# EAGLE design squematic (EAGLE 7.6.0)
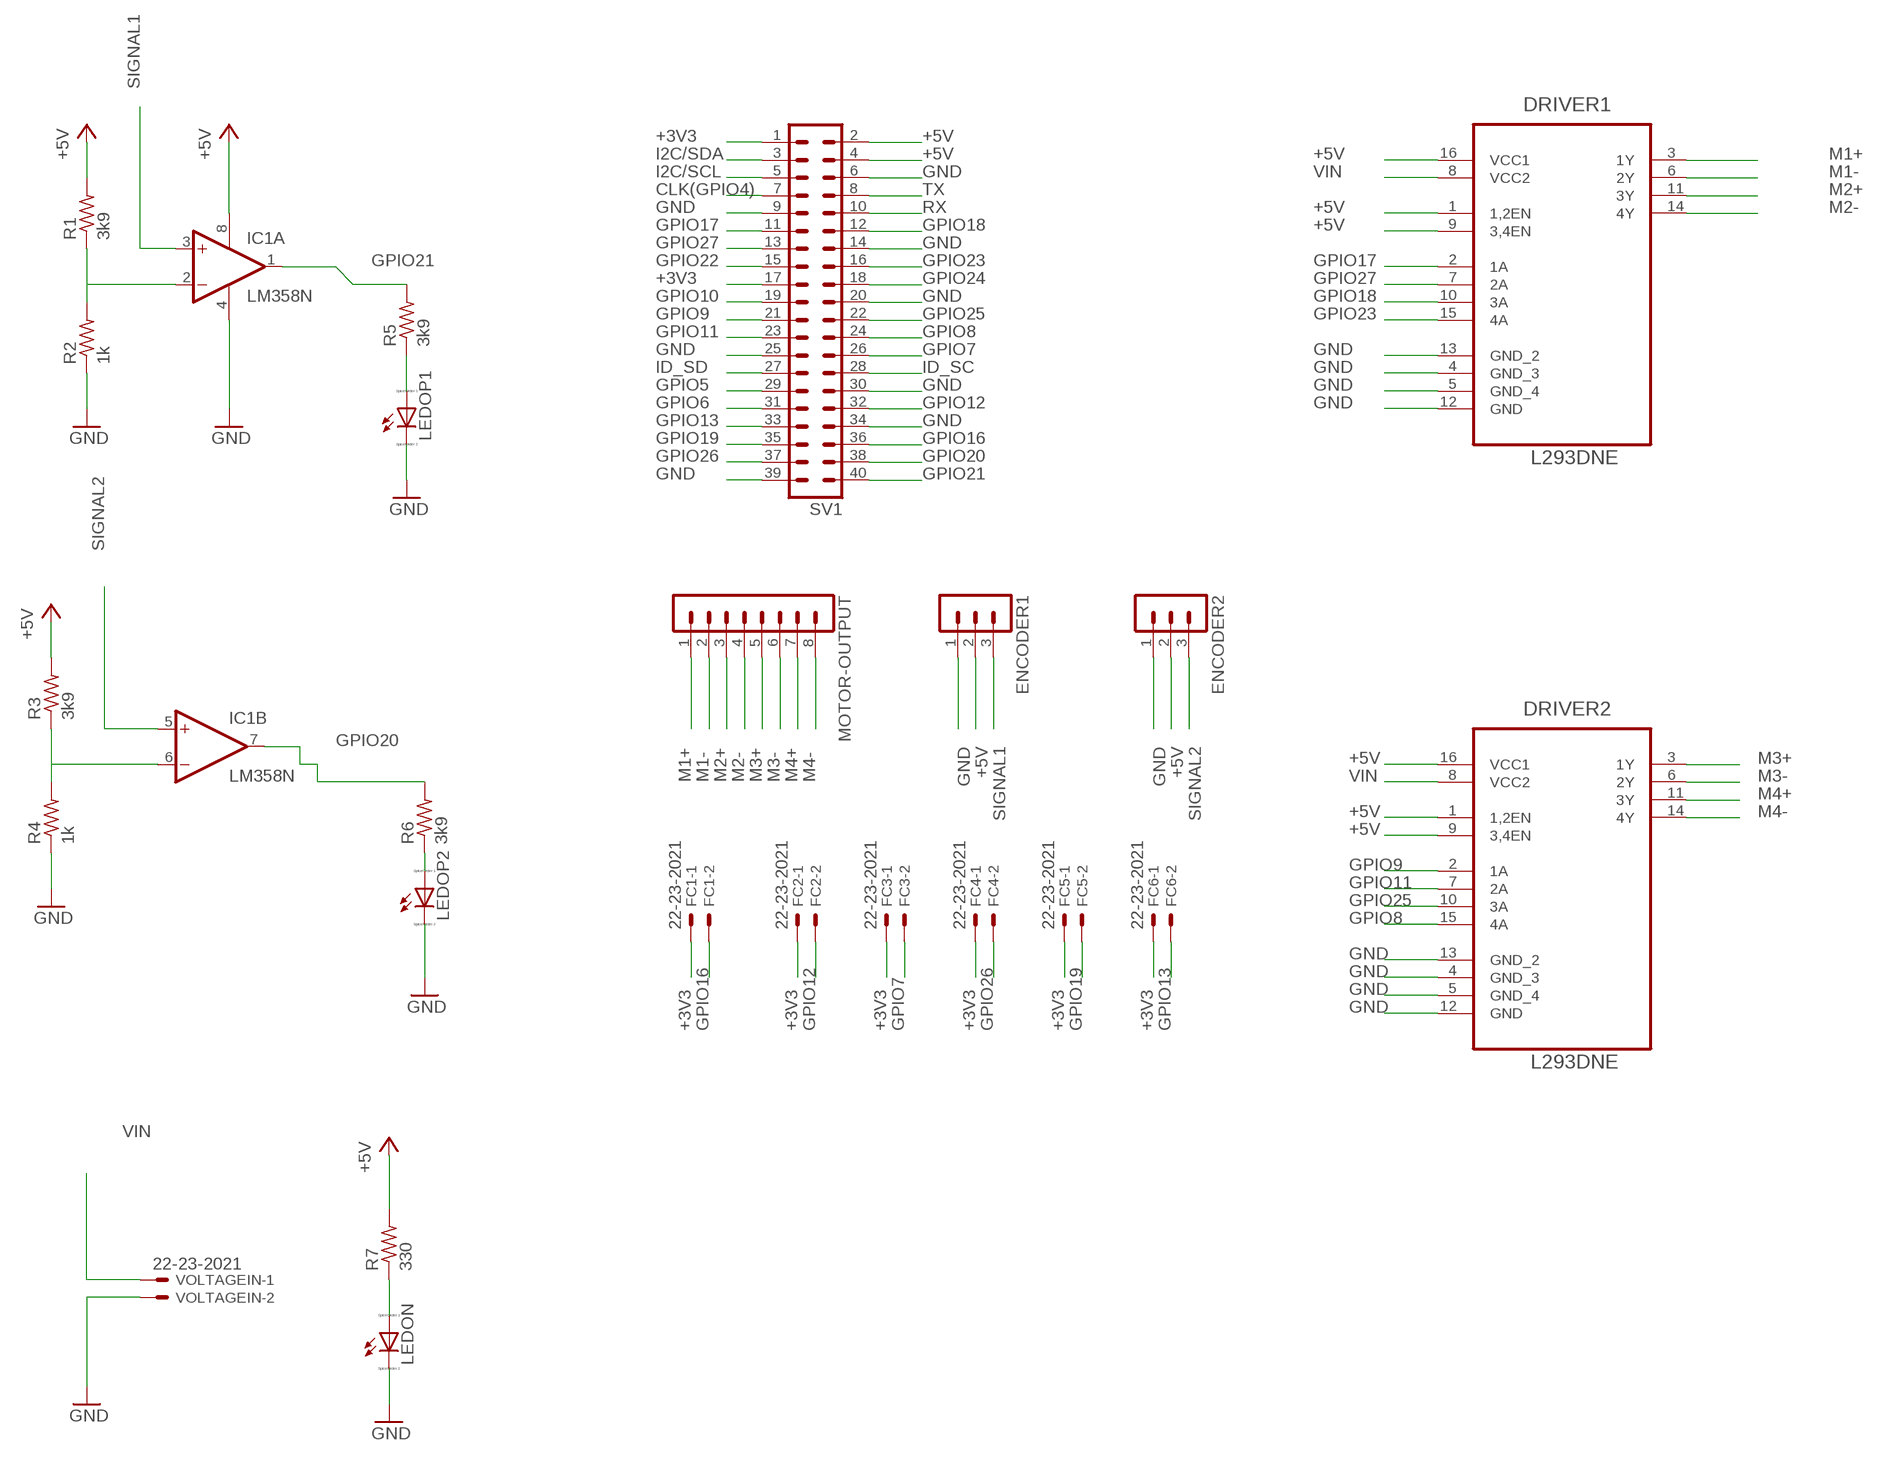
[diagram p0: schematic, sheet 1]

## Parts
DRIVER1  L293DNE  [DIP254P762X508-16]
DRIVER2  L293DNE  [DIP254P762X508-16]
ENCODER1  MA03-1  [MA03-1]
ENCODER2  MA03-1  [MA03-1]
FC1  22-23-2021  [22-23-2021]
FC2  22-23-2021  [22-23-2021]
FC3  22-23-2021  [22-23-2021]
FC4  22-23-2021  [22-23-2021]
FC5  22-23-2021  [22-23-2021]
FC6  22-23-2021  [22-23-2021]
IC1  LM358N  [DIL08]
LEDON  LED_ELD260  [LED_LD260]
LEDOP1  LED_ELD260  [LED_LD260]
LEDOP2  LED_ELD260  [LED_LD260]
MOTOR-OUTPUT  MA08-1  [MA08-1]
R1  3k9  R-US_0207/10  [0207/10]
R2  1k  R-US_0207/10  [0207/10]
R3  3k9  R-US_0207/10  [0207/10]
R4  1k  R-US_0207/10  [0207/10]
R5  3k9  R-US_0207/10  [0207/10]
R6  3k9  R-US_0207/10  [0207/10]
R7  330  R-US_0207/10  [0207/10]
SV1  MA20-2  [MA20-2]
VOLTAGEIN  22-23-2021  [22-23-2021]

## Nets
+3V3: FC1.1 FC2.1 FC3.1 FC4.1 FC5.1 FC6.1 SV1.1 SV1.17
+5V: DRIVER1.1(1,2EN) DRIVER1.9(3,4EN) DRIVER1.16(VCC1) DRIVER2.1(1,2EN) DRIVER2.9(3,4EN) DRIVER2.16(VCC1) ENCODER1.2 ENCODER2.2 IC1.8(P:V+) R1.2 R3.2 R7.2 SV1.2 SV1.4
CLK(GPIO4): SV1.7
GND: DRIVER1.4(GND_3) DRIVER1.5(GND_4) DRIVER1.12(GND) DRIVER1.13(GND_2) DRIVER2.4(GND_3) DRIVER2.5(GND_4) DRIVER2.12(GND) DRIVER2.13(GND_2) ENCODER1.1 ENCODER2.1 IC1.4(P:V-) LEDON.K(C) LEDOP1.K(C) LEDOP2.K(C) R2.1 R4.1 SV1.6 SV1.9 SV1.14 SV1.20 SV1.25 SV1.30 SV1.34 SV1.39 VOLTAGEIN.2
GPIO5: SV1.29
GPIO6: SV1.31
GPIO7: FC3.2 SV1.26
GPIO8: DRIVER2.15(4A) SV1.24
GPIO9: DRIVER2.2(1A) SV1.21
GPIO10: SV1.19
GPIO11: DRIVER2.7(2A) SV1.23
GPIO12: FC2.2 SV1.32
GPIO13: FC6.2 SV1.33
GPIO16: FC1.2 SV1.36
GPIO17: DRIVER1.2(1A) SV1.11
GPIO18: DRIVER1.10(3A) SV1.12
GPIO19: FC5.2 SV1.35
GPIO20: IC1.7(B:OUT) R6.2 SV1.38
GPIO21: IC1.1(A:OUT) R5.2 SV1.40
GPIO22: SV1.15
GPIO23: DRIVER1.15(4A) SV1.16
GPIO24: SV1.18
GPIO25: DRIVER2.10(3A) SV1.22
GPIO26: FC4.2 SV1.37
GPIO27: DRIVER1.7(2A) SV1.13
I2C/SCL: SV1.5
I2C/SDA: SV1.3
ID_SC: SV1.28
ID_SD: SV1.27
M1+: DRIVER1.3(1Y) MOTOR-OUTPUT.1
M1-: DRIVER1.6(2Y) MOTOR-OUTPUT.2
M2+: DRIVER1.11(3Y) MOTOR-OUTPUT.3
M2-: DRIVER1.14(4Y) MOTOR-OUTPUT.4
M3+: DRIVER2.3(1Y) MOTOR-OUTPUT.5
M3-: DRIVER2.6(2Y) MOTOR-OUTPUT.6
M4+: DRIVER2.11(3Y) MOTOR-OUTPUT.7
M4-: DRIVER2.14(4Y) MOTOR-OUTPUT.8
N$1: IC1.2(A:-IN) R1.1 R2.2
N$2: IC1.6(B:-IN) R3.1 R4.2
N$3: LEDOP1.A R5.1
N$7: LEDOP2.A R6.1
N$8: LEDON.A R7.1
RX: SV1.10
SIGNAL1: ENCODER1.3 IC1.3(A:+IN)
SIGNAL2: ENCODER2.3 IC1.5(B:+IN)
TX: SV1.8
VIN: DRIVER1.8(VCC2) DRIVER2.8(VCC2) VOLTAGEIN.1

## Library data of the parts
DRIVER1 DRIVER2 = Texas Instruments_By_element14_Batch_1:L293DNE: QUADRUPLE HALF-H DRIVERS; MPN: L293DNE; OC_FARNELL: 1470423; OC_NEWARK: 06F9523; PACKAGE: PDIP-16; SUPPLIER: Texas Instruments
ENCODER1 ENCODER2 = con-lstb:MA03-1: PIN HEADER; OC_FARNELL: unknown; OC_NEWARK: unknown
FC1-FC6 VOLTAGEIN = con-molex:22-23-2021: .100" (2.54mm) Center Header - 2 Pin; MF: MOLEX; MPN: 22-23-2021; OC_FARNELL: 1462926; OC_NEWARK: 25C3832
IC1 = linear:LM358: OP AMP also LM158; LM258; LM2904 Source: http://cache.national.com/ds/LM/LM158.pdf
LEDON LEDOP1 LEDOP2 = eagle-ltspice:LED_E: LED Source: http://www.osram.convergy.de Source: www.luxeon.com Source: www.kingbright.com; SPICEMODEL: NONE; SPICEPREFIX: D; SPICETYPE: diode
MOTOR-OUTPUT = con-lstb:MA08-1: PIN HEADER; OC_FARNELL: unknown; OC_NEWARK: unknown
R1-R7 = rcl:R-US_: RESISTOR, American symbol
SV1 = con-lstb:MA20-2: PIN HEADER; OC_FARNELL: unknown; OC_NEWARK: unknown

## Board
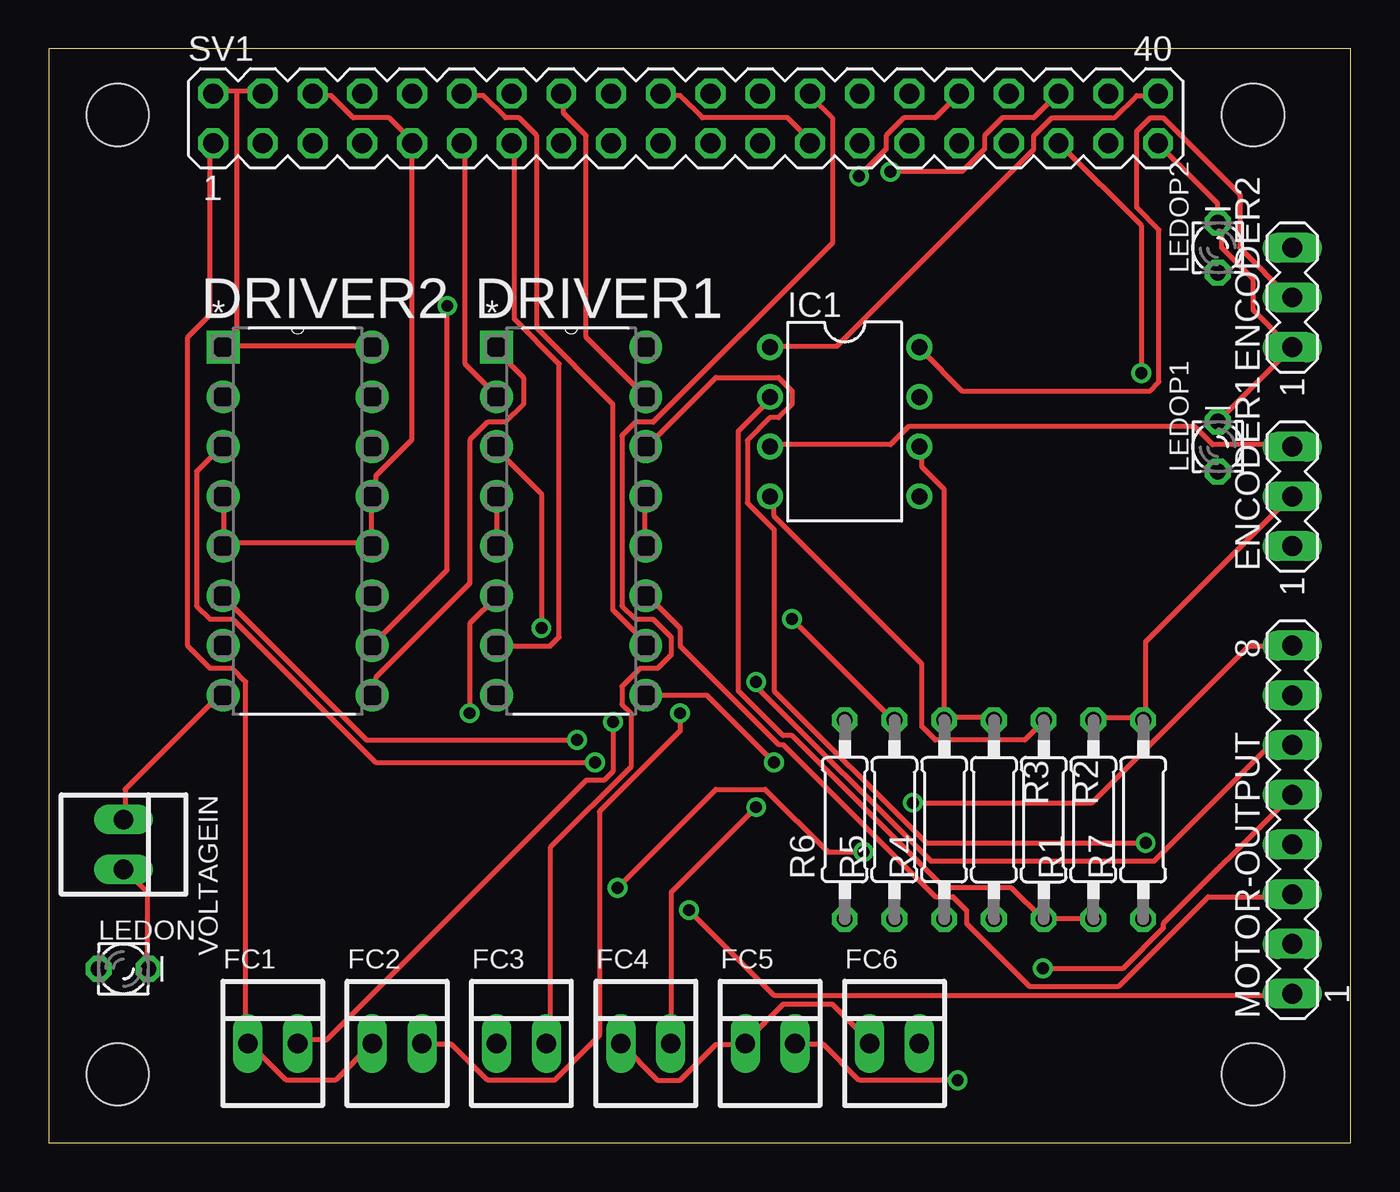
[diagram p1: board, top side]
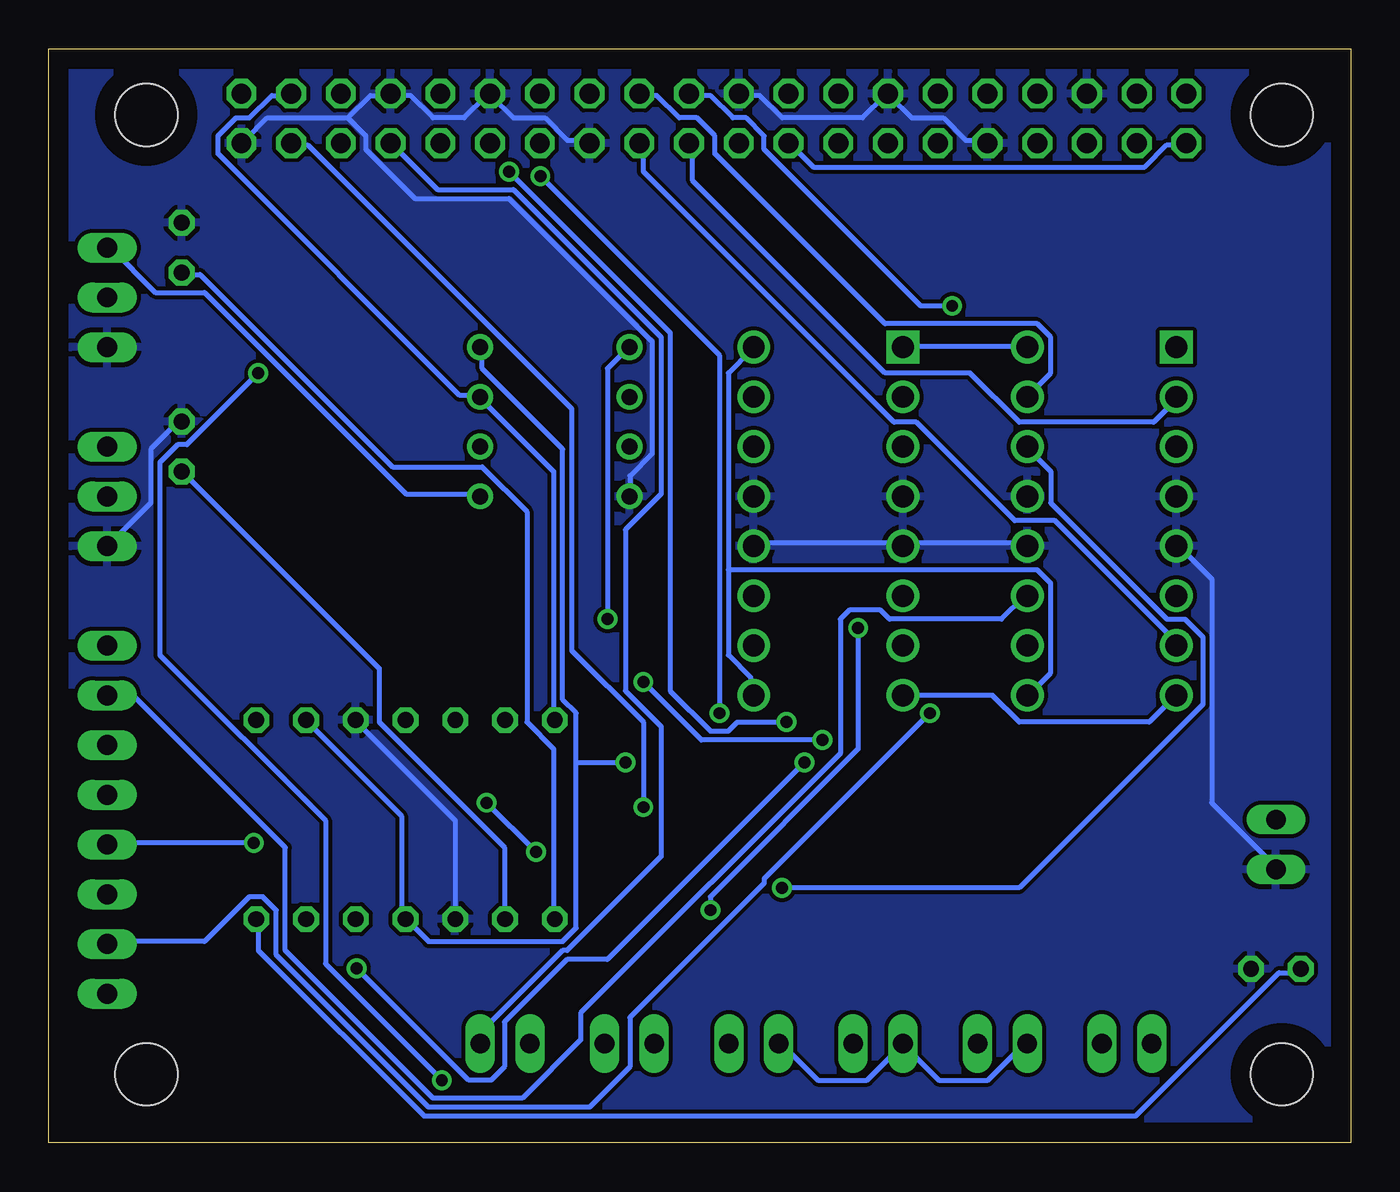
[diagram p2: board, bottom side, seen from below]

Size 66.47 x 55.87 mm. Coordinates in mm from the lower left corner, seen from the top.
Outline: 0,0 66.47,0 66.47,55.87 0,55.87 0,0
Copper layers (1*16): Top 0.035mm / dielectric 1.5mm / Bottom 0.035mm
Design rules "default": minimum track width 10mil, minimum drill 24mil, track to track 8mil, track to pad 8mil, pad to pad 8mil, via to via 8mil, smd to smd 8mil, copper to edge 40mil, drill to drill 8mil, minimum pad ring 10mil, minimum via ring 8mil, stop-mask expansion 4mil, vias tented up to drill 0mil, thermal gap 10mil
Holes 3.17 mm at 3.51,52.5 61.49,52.5 61.49,3.51 3.51,3.51

### Footprints (pad centres in the part's own frame; a part is rotated, then mirrored left to right if it is on the bottom)
DIP254P762X508-16 = drill 1.118 square: 1 -7.62,17.78 | drill 1.118: 2 -7.62,15.24; 3 -7.62,12.7; 4 -7.62,10.16; 5 -7.62,7.62; 6 -7.62,5.08; 7 -7.62,2.54; 8 -7.62,0; 9 0,0; 10 0,2.54; 11 0,5.08; 12 0,7.62; 13 0,10.16; 14 0,12.7; 15 0,15.24; 16 0,17.78
MA03-1 = drill 1.016 long: 1 -2.54,0; 2 0,0; 3 2.54,0
22-23-2021 = drill 1 long: 1 -1.27,0; 2 1.27,0
DIL08 = drill 0.813 pad 1.27: 1 -3.81,-3.81; 2 -1.27,-3.81; 3 1.27,-3.81; 4 3.81,-3.81; 5 3.81,3.81; 6 1.27,3.81; 7 -1.27,3.81; 8 -3.81,3.81
LED_LD260 = drill 0.813 octagon: A -1.27,0; K 1.27,0
MA08-1 = drill 1.016 long: 1 -8.89,0; 2 -6.35,0; 3 -3.81,0; 4 -1.27,0; 5 1.27,0; 6 3.81,0; 7 6.35,0; 8 8.89,0
0207/10 = drill 0.813 octagon: 1 -5.08,0; 2 5.08,0
MA20-2 = drill 1.016 octagon: 1 -24.13,-1.27; 2 -24.13,1.27; 3 -21.59,-1.27; 4 -21.59,1.27; 5 -19.05,-1.27; 6 -19.05,1.27; 7 -16.51,-1.27; 8 -16.51,1.27; 9 -13.97,-1.27; 10 -13.97,1.27; 11 -11.43,-1.27; 12 -11.43,1.27; 13 -8.89,-1.27; 14 -8.89,1.27; 15 -6.35,-1.27; 16 -6.35,1.27; 17 -3.81,-1.27; 18 -3.81,1.27; 19 -1.27,-1.27; 20 -1.27,1.27; 21 1.27,-1.27; 22 1.27,1.27; 23 3.81,-1.27; 24 3.81,1.27; 25 6.35,-1.27; 26 6.35,1.27; 27 8.89,-1.27; 28 8.89,1.27; 29 11.43,-1.27; 30 11.43,1.27; 31 13.97,-1.27; 32 13.97,1.27; 33 16.51,-1.27; 34 16.51,1.27; 35 19.05,-1.27; 36 19.05,1.27; 37 21.59,-1.27; 38 21.59,1.27; 39 24.13,-1.27; 40 24.13,1.27

### Placement (x,y rotation side)
DRIVER1  30.48,22.86 0 top
DRIVER2  16.51,22.86 0 top
ENCODER1  63.5,33.02 90 top
ENCODER2  63.5,43.18 90 top
FC1  11.43,5.08 0 top
FC2  17.78,5.08 0 top
FC3  24.13,5.08 0 top
FC4  30.48,5.08 0 top
FC5  36.83,5.08 0 top
FC6  43.18,5.08 0 top
IC1  40.64,36.83 270 top
LEDON  3.81,8.89 0 top
LEDOP1  59.69,35.56 90 top
LEDOP2  59.69,45.72 90 top
MOTOR-OUTPUT  63.5,16.51 90 top
R1  53.34,16.51 90 top
R2  50.8,16.51 270 top
R3  48.26,16.51 270 top
R4  45.72,16.51 90 top
R5  330  [0207/10]  43.18,16.51 90 top
R6  330  [0207/10]  40.64,16.51 90 top
R7  55.88,16.51 90 top
SV1  32.51,52.32 0 top
VOLTAGEIN  3.81,15.24 270 top

### Tracks (layer width: path | path; a pad name or v marks a point on that pad's centre or on a via)
+3V3
  Top 0.254: FC6.1 41.83,5.26 40.01,7.09 37.49,7.09 35.66,5.26 FC5.1 35.43,5.03 34.06,5.03 32.23,3.2 31.09,3.2 FC4.1 | FC2.1 14.63,3.2 12.12,3.2 10.29,5.03 FC1.1 10.06,5.26 10.06,23.55 9.37,24.23 8.23,24.23 7.09,25.38 7.09,41.15 8.23,42.29 8.23,50.98 SV1.1
  Bottom 0.254: SV1.1 8.46,50.98 9.37,50.98 10.52,49.84 27.43,49.84 28.57,50.98 SV1.17 | 22.86,5.03 24.69,3.2 27.2,3.2 29.03,5.03 FC4.1 | 22.86,5.03 21.03,3.2 18.52,3.2 16.69,5.03 FC2.1 | 22.86,5.03 FC3.1
+5V  (via drill 0.61)
  Top 0.254: 9.6,53.72 10.74,53.72 SV1.4 | 9.6,53.72 8.46,53.72 SV1.2 | 9.6,40.69 16.46,40.69 DRIVER2.16 | 9.6,40.69 8.91,40.69 DRIVER2.1 9.6,40.69 | 9.6,40.69 9.6,53.72 | DRIVER2.9 16.69,22.86 16.69,23.77 21.49,28.57 21.49,35.89 22.4,36.8 23.32,36.8 24.23,37.72 24.23,39.09 22.86,40.46 DRIVER1.1 | R1.2 53.49,21.72 55.78,21.72 R7.2 56.01,21.72 56.01,25.6 63.32,32.92 ENCODER1.2 | ENCODER2.2 63.32,43.2 60.81,45.72 60.81,48.46 56.92,52.35 56.24,52.35 55.55,51.66 55.55,47.78 56.69,46.63 56.69,38.86 56.24,38.41 46.63,38.41 44.58,40.46 IC1.8 | DRIVER1.9 33.6,22.86 v37.03,19.43
  Bottom 0.254: 31.77,29.26 31.77,39.32 30.63,40.46 DRIVER1.16 | 31.77,29.26 31.77,24.92 30.63,23.77 30.63,22.86 DRIVER1.9 | 31.77,29.26 16,29.26 15.32,28.57 15.32,24 16.46,22.86 DRIVER2.9 | DRIVER2.16 16.69,40.69 22.86,40.69 DRIVER1.1 | R1.2 53.26,21.49 48.46,16.69 48.46,11.43 R3.2 48.23,11.43 47.09,10.29 40.23,10.29 39.55,10.97 39.55,19.43 | 39.55,19.43 39.55,21.95 40.23,22.63 40.23,35.43 44.35,39.55 44.35,40.46 IC1.8 | 39.55,19.43 v37.03,19.43
GND
  Top 0.254: LEDON.K 5.03,8.91 5.03,12.8 3.89,13.95 VOLTAGEIN.2 | DRIVER1.12 30.4,30.63 30.4,32.92 DRIVER1.13 | DRIVER1.4 DRIVER1.5 | 8.91,30.63 8.91,32.92 DRIVER2.4 | 16.46,30.63 16.46,32.92 DRIVER2.13 16.69,33.15 16.69,34.06 18.52,35.89 18.52,50.98 SV1.9 18.52,51.21 17.37,52.35 15.54,52.35 14.4,53.49 13.49,53.49 SV1.6 | 16.46,30.63 8.91,30.63 | 8.91,30.63 DRIVER2.5 | 16.46,30.63 DRIVER2.12 | IC1.4 37.03,32.92 37.03,32 44.58,24.46 44.58,21.26 45.26,20.57 49.84,20.57 50.75,21.49 R2.1 | SV1.39 56.69,50.98 59.66,48.01 59.66,47.09 LEDOP2.K 59.89,46.86 59.89,45.72 61.49,44.12 61.49,42.52 63.32,40.69 ENCODER2.1 LEDOP1.K | SV1.20 31.32,53.49 32.23,53.49 33.38,52.35 37.72,52.35 38.86,51.21 SV1.25
  Bottom 0.254: 22.86,30.63 16.69,30.63 DRIVER2.12 | 22.86,30.63 30.4,30.63 DRIVER1.12 | 22.86,30.63 DRIVER1.5 | VOLTAGEIN.2 3.89,14.17 7.09,17.37 7.09,28.8 8.69,30.4 DRIVER2.5 | R4.1 45.72,16.46 50.75,21.49 R2.1 | SV1.9 18.75,51.21 19.66,51.21 20.8,52.35 22.4,52.35 23.55,53.49 SV1.14 23.77,53.49 24.92,52.35 29.03,52.35 30.18,53.49 31.09,53.49 SV1.20 | SV1.25 38.86,51.21 40.01,51.21 41.15,52.35 42.75,52.35 43.89,53.49 SV1.30 44.12,53.49 45.26,52.35 46.86,52.35 48.01,53.49 48.92,53.49 SV1.34 49.15,53.49 50.06,53.49 51.21,52.35 | ENCODER1.1 63.32,30.63 61.27,32.69 61.27,35.43 59.89,36.8 LEDOP1.K | 51.21,52.35 55.32,52.35 56.46,51.21 SV1.39 | 51.21,52.35 50.29,51.44 50.29,50.75 47.78,48.23 42.98,48.23 35.66,40.92 35.66,35.2 36.8,34.06 36.8,33.15 IC1.4
  pour Bottom: 0,55.88 66.55,55.88 66.55,-0.51 0,-0.51 0,-0.25
GPIO7
  Top 0.254: FC3.2 25.6,5.26 25.6,15.09 29.72,19.2 29.72,21.95 29.26,22.4 29.26,23.32 30.18,24.23 31.09,24.23 31.77,24.92 31.77,25.83 30.86,26.75 29.95,26.75 29.26,27.43 29.26,36.12 29.95,36.8 30.86,36.8 40.01,45.95 40.01,52.35 38.86,53.49 SV1.26
GPIO8
  Bottom 0.254: SV1.24 36.12,53.49 35.43,53.49 34.29,52.35 33.38,52.35 32.46,51.44 32.46,50.52 23.77,41.83 16,41.83 15.32,41.15 15.32,39.32 16.46,38.18 DRIVER2.15
GPIO9
  Bottom 0.254: SV1.21 33.6,50.98 33.6,49.15 23.77,39.32 19.43,39.32 16.92,36.8 10.06,36.8 8.91,37.95 DRIVER2.2
GPIO11
  Bottom 0.254: SV1.23 36.12,50.98 36.12,49.61 23.32,36.8 22.17,36.8 17.14,31.77 15.09,31.77 8.91,25.6 DRIVER2.7
GPIO12  (via drill 0.61)
  Top 0.254: v32.23,21.95 32.23,21.03 28.12,16.92 28.12,5.49 25.83,3.2 22.4,3.2 20.57,5.03 19.2,5.03 FC2.2 | v41.38,49.38 42.75,50.75 42.75,51.44 43.66,52.35 45.26,52.35 46.41,53.49 SV1.32
  Bottom 0.254: v32.23,21.95 32.23,40.23 v41.38,49.38
GPIO13
  Bottom 0.254: FC6.2 44.35,5.26 44.35,5.71 40.23,9.83 40.01,9.83 35.2,14.63 35.2,21.26 37.03,23.09 37.03,31.32 35.2,33.15 35.2,41.15 42.75,48.69 46.63,48.69 48.92,50.98 SV1.33
GPIO16  (via drill 0.61)
  Top 0.254: v28.8,21.49 28.8,18.97 28.35,18.52 27.43,18.52 14.17,5.26 12.8,5.26 FC1.2 | v42.98,49.61 46.63,49.61 47.78,50.75 47.78,51.44 48.69,52.35 50.29,52.35 51.44,53.49 SV1.36
  Bottom 0.254: v28.8,21.49 31.32,21.49 31.77,21.03 32.69,21.03 34.75,23.09 34.75,41.38 v42.98,49.61
GPIO17
  Top 0.254: SV1.11 21.26,50.98 21.26,39.78 22.86,38.18 DRIVER1.2
GPIO18
  Top 0.254: SV1.12 21.26,53.49 22.17,53.49 23.32,52.35 24,52.35 24.92,51.44 24.92,41.6 28.8,37.72 28.8,27.2 30.4,25.6 DRIVER1.10
GPIO19  (via drill 0.61)
  Top 0.254: v46.41,3.2 41.38,3.2 39.55,5.03 38.18,5.03 FC5.2 | v55.78,39.32 55.78,46.86 51.66,50.98 SV1.35
  Bottom 0.254: v46.41,3.2 52.35,9.14 52.35,16.46 60.81,24.92 60.81,34.75 59.89,35.66 59.44,35.66 v55.78,39.32
GPIO20
  Bottom 0.254: R6.2 40.69,21.72 40.69,34.29 44.35,37.95 IC1.7 44.58,38.18 45.49,38.18 57.84,50.52 57.84,51.44 56.92,52.35 56.24,52.35 55.09,53.49 54.18,53.49 SV1.38
GPIO21  (via drill 0.61)
  Top 0.254: v37.95,26.75 42.98,21.72 R5.2 | SV1.40 56.46,53.49 55.55,53.49 54.41,52.35 51.21,52.35 50.29,51.44 50.29,50.75 40.23,40.69 37.03,40.69 IC1.1
  Bottom 0.254: v37.95,26.75 37.95,39.55 37.03,40.46 IC1.1
GPIO23
  Top 0.254: DRIVER1.15 27.43,41.15 27.43,51.44 26.29,52.58 26.29,53.49 SV1.16
GPIO25  (via drill 0.61)
  Top 0.254: v20.34,42.75 20.34,29.26 16.69,25.6 DRIVER2.10
  Bottom 0.254: v20.34,42.75 21.95,42.75 29.95,50.75 29.95,51.44 30.86,52.35 31.55,52.35 32.69,53.49 33.6,53.49 SV1.22
GPIO26  (via drill 0.61)
  Top 0.254: v36.12,17.14 31.77,12.8 31.77,5.26 FC4.2
  Bottom 0.254: v36.12,17.14 36.12,21.49 39.78,25.15 39.78,37.49 53.26,50.98 53.95,50.98 SV1.37
GPIO27
  Top 0.254: SV1.13 23.77,50.98 23.77,42.06 26.06,39.78 26.06,25.83 25.6,25.38 22.86,25.38 DRIVER1.7
M1+  (via drill 0.61)
  Top 0.254: v32.69,11.89 37.03,7.54 63.32,7.54 MOTOR-OUTPUT.1 | v25.15,26.29 25.15,33.15 22.86,35.43 DRIVER1.3
  Bottom 0.254: v32.69,11.89 32.69,12.57 25.15,20.12 v25.15,26.29
M1-  (via drill 0.61)
  Top 0.254: v21.49,21.95 21.49,26.52 22.86,27.89 DRIVER1.6
  Bottom 0.254: v21.49,21.95 29.95,13.49 29.95,13.26 36.8,6.4 36.8,3.89 38.86,1.83 47.09,1.83 54.86,9.6 54.86,11.89 55.55,12.57 56.24,12.57 58.52,10.29 63.32,10.29 MOTOR-OUTPUT.2
M2+
  Top 0.254: MOTOR-OUTPUT.3 63.32,12.57 59.21,12.57 54.63,8 50.06,8 46.86,11.2 46.86,11.89 46.18,12.57 45.26,12.57 37.49,20.34 37.26,20.34 32.23,25.38 32.23,26.29 30.63,27.89 DRIVER1.11
M2-  (via drill 0.61)
  Top 0.254: v56.01,15.32 44.81,15.32 37.03,23.09 37.03,31.32 35.66,32.69 35.66,35.89 36.8,37.03 37.26,37.03 37.95,37.72 37.95,38.41 37.26,39.09 34.06,39.09 30.63,35.66 DRIVER1.14
  Bottom 0.254: v56.01,15.32 63.32,15.32 MOTOR-OUTPUT.4
M3+  (via drill 0.61)
  Top 0.254: MOTOR-OUTPUT.5 56.92,11.2 56.92,10.97 54.86,8.91 v50.75,8.91 | v27.89,19.43 16.69,19.43 9.37,26.75 8.23,26.75 7.54,27.43 7.54,34.29 8.69,35.43 DRIVER2.3
  Bottom 0.254: v50.75,8.91 45.03,3.2 43.89,3.2 43.2,3.89 43.2,6.17 40.01,9.37 37.95,9.37 v27.89,19.43
M3-  (via drill 0.61)
  Top 0.254: v36.12,23.55 36.12,23.32 45.03,14.4 56.46,14.4 62.18,20.12 63.32,20.12 MOTOR-OUTPUT.6 | v26.98,20.57 16.23,20.57 8.91,27.89 DRIVER2.6
  Bottom 0.254: v36.12,23.55 33.15,20.57 v26.98,20.57
M4+
  Bottom 0.254: MOTOR-OUTPUT.7 62.18,22.86 54.41,15.09 54.41,9.83 46.86,2.29 42.29,2.29 39.32,5.26 39.32,6.63 26.06,19.89 26.06,26.75 25.6,27.2 24,27.2 23.55,26.75 17.83,26.75 16.69,27.89 DRIVER2.11
M4-  (via drill 0.61)
  Top 0.254: v44.12,17.37 53.26,17.37 61.27,25.38 63.32,25.38 MOTOR-OUTPUT.8 | v41.6,14.86 39.78,14.86 36.58,18.06 34.06,18.06 v29.03,13.03
  Bottom 0.254: v41.6,14.86 v44.12,17.37 | v29.03,13.03 16.92,13.03 7.54,22.4 7.54,25.83 8.46,26.75 9.37,26.75 15.32,32.69 15.32,34.29 16.46,35.43 DRIVER2.14
N$1
  Top 0.254: R1.1 R2.2 50.75,11.43 49.15,13.03 45.72,13.03 37.95,20.8 37.49,20.8 35.2,23.09 35.2,36.35 36.8,37.95 IC1.2
N$2
  Top 0.254: 45.72,21.72 48.23,21.72 R3.1 | 45.72,21.72 45.72,33.38 44.58,34.52 44.58,35.43 IC1.6 | 45.72,21.72 R4.2
N$3
  Bottom 0.254: R5.1 43.2,11.43 43.2,15.09 49.61,21.49 49.61,24.23 59.66,34.29 LEDOP1.A
N$7
  Bottom 0.254: R6.1 40.69,11.43 40.69,20.12 42.06,21.49 42.06,32.23 44.35,34.52 48.92,34.52 58.75,44.35 59.66,44.35 LEDOP2.A
N$8
  Bottom 0.254: LEDON.A 2.74,8.69 3.66,8.69 10.97,1.37 47.32,1.37 55.78,9.83 55.78,11.43 R7.1
SIGNAL1
  Top 0.254: IC1.3 37.03,35.66 42.98,35.66 43.89,36.58 58.52,36.58 59.44,35.66 63.32,35.66 ENCODER1.3
SIGNAL2
  Bottom 0.254: IC1.5 44.58,33.15 48.23,33.15 58.52,43.43 61.04,43.43 63.32,45.72 ENCODER2.3
VIN
  Top 0.254: VOLTAGEIN.1 3.89,16.69 3.89,18.06 8.69,22.86 DRIVER2.8
  Bottom 0.254: DRIVER1.8 18.29,22.86 16.92,21.49 10.29,21.49 8.91,22.86 DRIVER2.8